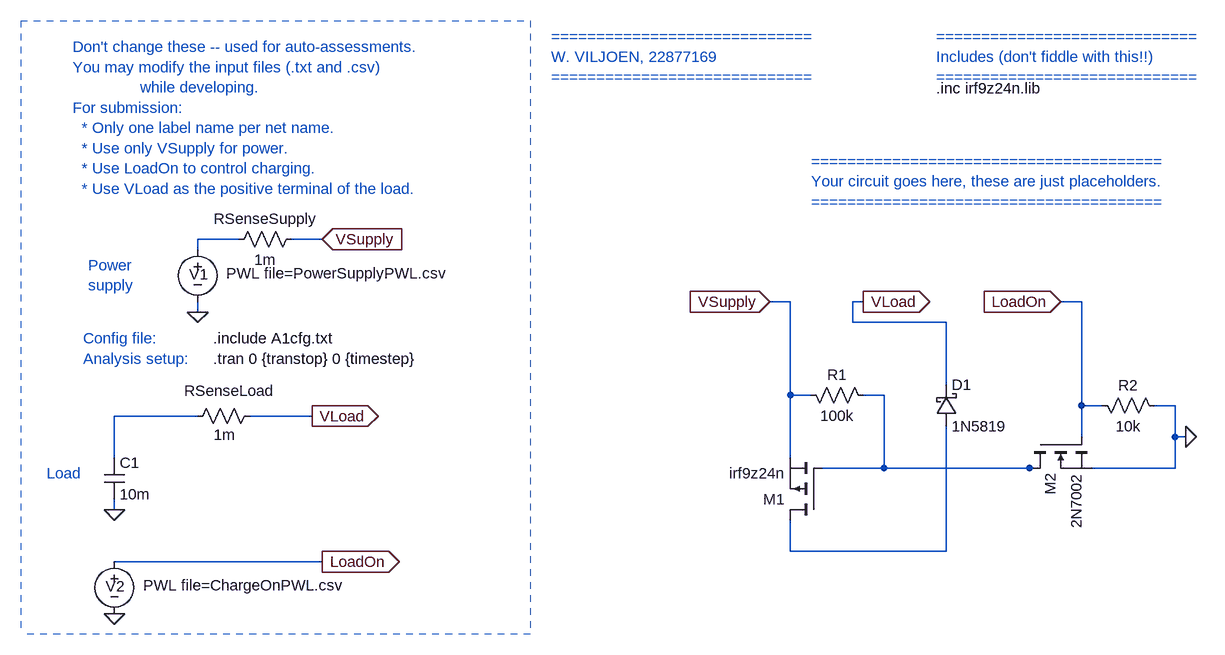
[diagram p0: schematic E344_22877169_A1.asc]
E344_22877169_A1.asc, the LTspice schematic file:
Version 4
SHEET 1 1824 680
WIRE -2032 -1088 -2096 -1088
WIRE -1904 -1088 -1952 -1088
WIRE -2096 -1072 -2096 -1088
WIRE -1184 -992 -1216 -992
WIRE -1072 -992 -1088 -992
WIRE -736 -992 -768 -992
WIRE -2096 -976 -2096 -992
WIRE -1088 -960 -1088 -992
WIRE -944 -960 -1088 -960
WIRE -944 -864 -944 -960
WIRE -1184 -848 -1184 -992
WIRE -1152 -848 -1184 -848
WIRE -1040 -848 -1072 -848
WIRE -736 -832 -736 -992
WIRE -704 -832 -736 -832
WIRE -592 -832 -624 -832
WIRE -2096 -816 -2224 -816
WIRE -1920 -816 -2016 -816
WIRE -736 -784 -736 -832
WIRE -592 -784 -592 -832
WIRE -576 -784 -592 -784
WIRE -2224 -752 -2224 -816
WIRE -1184 -752 -1184 -848
WIRE -1040 -736 -1040 -848
WIRE -1040 -736 -1136 -736
WIRE -816 -736 -1040 -736
WIRE -800 -736 -816 -736
WIRE -592 -736 -592 -784
WIRE -592 -736 -720 -736
WIRE -2224 -672 -2224 -688
WIRE -1184 -608 -1184 -656
WIRE -944 -608 -944 -800
WIRE -944 -608 -1184 -608
WIRE -1904 -592 -2224 -592
FLAG -2096 -976 0
FLAG -1904 -1088 VSupply
IOPIN -1904 -1088 In
FLAG -1920 -816 VLoad
IOPIN -1920 -816 Out
FLAG -1904 -592 LoadOn
IOPIN -1904 -592 Out
FLAG -2224 -512 0
FLAG -1216 -992 VSupply
IOPIN -1216 -992 In
FLAG -1072 -992 VLoad
IOPIN -1072 -992 Out
FLAG -768 -992 LoadOn
IOPIN -768 -992 In
FLAG -2224 -672 0
FLAG -576 -784 0
SYMBOL voltage -2096 -1088 R0
WINDOW 123 0 0 Left 0
WINDOW 39 0 0 Left 0
WINDOW 3 44 52 Left 2
WINDOW 0 -13 54 Left 2
SYMATTR Value PWL file=PowerSupplyPWL.csv
SYMATTR InstName V1
SYMBOL res -2000 -832 R90
WINDOW 0 -7 47 VBottom 2
WINDOW 3 29 54 VTop 2
SYMATTR InstName RSenseLoad
SYMATTR Value 1m
SYMBOL res -2048 -1072 R270
WINDOW 0 32 56 VTop 2
WINDOW 3 0 56 VBottom 2
SYMATTR InstName RSenseSupply
SYMATTR Value 1m
SYMBOL cap -2240 -752 R0
SYMATTR InstName C1
SYMATTR Value 10m
SYMATTR SpiceLine2 IC=0
SYMBOL voltage -2224 -608 R0
WINDOW 123 0 0 Left 0
WINDOW 39 0 0 Left 0
WINDOW 3 44 52 Left 2
WINDOW 0 -13 54 Left 2
SYMATTR Value PWL file=ChargeOnPWL.csv
SYMATTR InstName V2
SYMBOL pmos -1136 -656 R180
SYMATTR InstName M1
SYMATTR Value irf9z24n
SYMATTR Prefix X
SYMATTR SpiceModel irf9z24n
SYMBOL nmos -816 -784 M90
SYMATTR InstName M2
SYMATTR Value 2N7002
SYMBOL schottky -960 -800 M180
WINDOW 0 24 64 Left 2
WINDOW 3 24 0 Left 2
SYMATTR InstName D1
SYMATTR Value 1N5819
SYMATTR Description Diode
SYMATTR Type diode
SYMBOL res -1168 -864 M90
WINDOW 0 0 56 VBottom 2
WINDOW 3 32 56 VTop 2
SYMATTR InstName R1
SYMATTR Value 100k
SYMBOL res -720 -848 M90
WINDOW 0 0 56 VBottom 2
WINDOW 3 32 56 VTop 2
SYMATTR InstName R2
SYMATTR Value 10k
TEXT -2072 -904 Left 2 !.tran 0 {transtop} 0 {timestep}
TEXT -2072 -936 Left 2 !.include A1cfg.txt
TEXT -2288 -1384 Left 2 ;Don't change these -- used for auto-assessments.\nYou may modify the input files (.txt and .csv) \n               while developing.\nFor submission: \n  * Only one label name per net name.\n  * Use only VSupply for power.\n  * Use LoadOn to control charging.\n  * Use VLoad as the positive terminal of the load.
TEXT -2272 -936 Left 2 ;Config file:
TEXT -2272 -904 Left 2 ;Analysis setup:
TEXT -2328 -728 Left 2 ;Load
TEXT -2264 -1048 Left 2 ;Power\nsupply
TEXT -1552 -1400 Left 2 ;=============================\nW. VILJOEN, 22877169\n=============================
TEXT -960 -1320 Left 2 !.inc irf9z24n.lib
TEXT -960 -1400 Left 2 ;=============================\nIncludes (don't fiddle with this!!)\n=============================
TEXT -1152 -1208 Left 2 ;=======================================\nYour circuit goes here, these are just placeholders.\n=======================================
LINE Normal -1584 -1424 -1584 -480 2
LINE Normal -2368 -1424 -1584 -1424 2
LINE Normal -1584 -480 -2368 -480 2
LINE Normal -1584 -496 -1584 -496 2
LINE Normal -2368 -1424 -2368 -480 2

The netlist it stands for:
* E344_22877169_A1.asc
V1 N001 0 PWL file=PowerSupplyPWL.csv
RSenseLoad VLoad N003 1m
RSenseSupply N001 VSupply 1m
C1 N003 0 10m IC=0
V2 LoadOn 0 PWL file=ChargeOnPWL.csv
XM1 N004 N002 VSupply irf9z24n irf9z24n  ; pins D G S
M2 N002 LoadOn 0 0 2N7002
D1 N004 VLoad 1N5819
R1 VSupply N002 100k
R2 LoadOn 0 10k
.model D D
.lib standard.dio
.model NMOS NMOS
.model PMOS PMOS
.lib standard.mos
.tran 0 {transtop} 0 {timestep}
.include A1cfg.txt
* Don't change these -- used for auto-assessments.
* You may modify the input files (.txt and .csv)
*                while developing.
* For submission:
*   * Only one label name per net name.
*   * Use only VSupply for power.
*   * Use LoadOn to control charging.
*   * Use VLoad as the positive terminal of the load.
* Config file:
* Analysis setup:
* Load
* Power
* supply
* =============================
* W. VILJOEN, 22877169
* =============================
.inc irf9z24n.lib
* =============================
* Includes (don't fiddle with this!!)
* =============================
* =======================================
* Your circuit goes here, these are just placeholders.
* =======================================
.backanno
.end